# EAGLE design SFXCS (EAGLE 5.07)
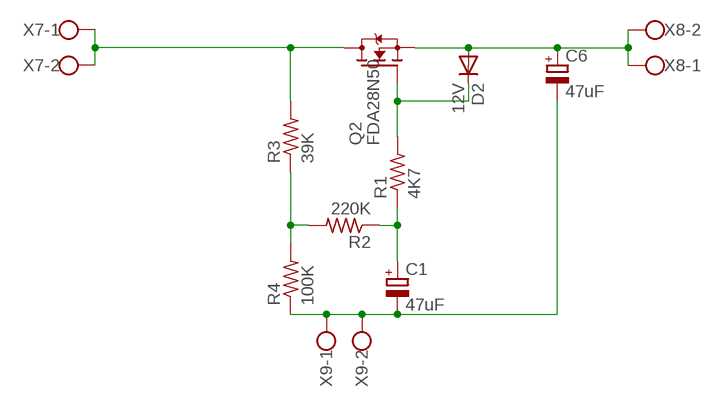
[diagram p0: schematic, sheet 1]

## Parts
C1  47uF  CPOL-EUE10-20  [EB20D]
C6  47uF  CPOL-EUE10-30  [EB30D]
D2  12V  1N4004  [DO41-10]
Q2  FDA28N50  SPW47N60S5  [P-TO247]
R1  4K7  R-US_0617/22  [0617/22]
R2  220K  R-US_0617/22  [0617/22]
R3  39K  R-US_0617/22  [0617/22]
R4  100K  R-US_0617/22  [0617/22]
X7  W237-02P  [W237-132]
X8  W237-02P  [W237-132]
X9  W237-02P  [W237-132]

## Nets
N$2: Q2.2(D) R3.2 X7.1 X7.2
N$7: D2.C Q2.1(G) R1.2
N$8: C1.+ R1.1 R2.1
N$9: R2.2 R3.1 R4.2
N$12: C6.+ D2.A Q2.3(S) X8.1 X8.2
N$14: C1.- C6.- R4.1 X9.1 X9.2

## Library data of the parts
C1 C6 = resistor:CPOL-EU: POLARIZED CAPACITOR, European symbol
D2 = diode:1N4004: DIODE general purpose rectifier, 1 A
Q2 = transistor-fet:SPW47N60S5: Cool MOS Power Transistor
R1-R4 = resistor:R-US_: RESISTOR, American symbol
X7-X9 = con-wago-508:W237-02P: WAGO SREW CLAMP

## Board
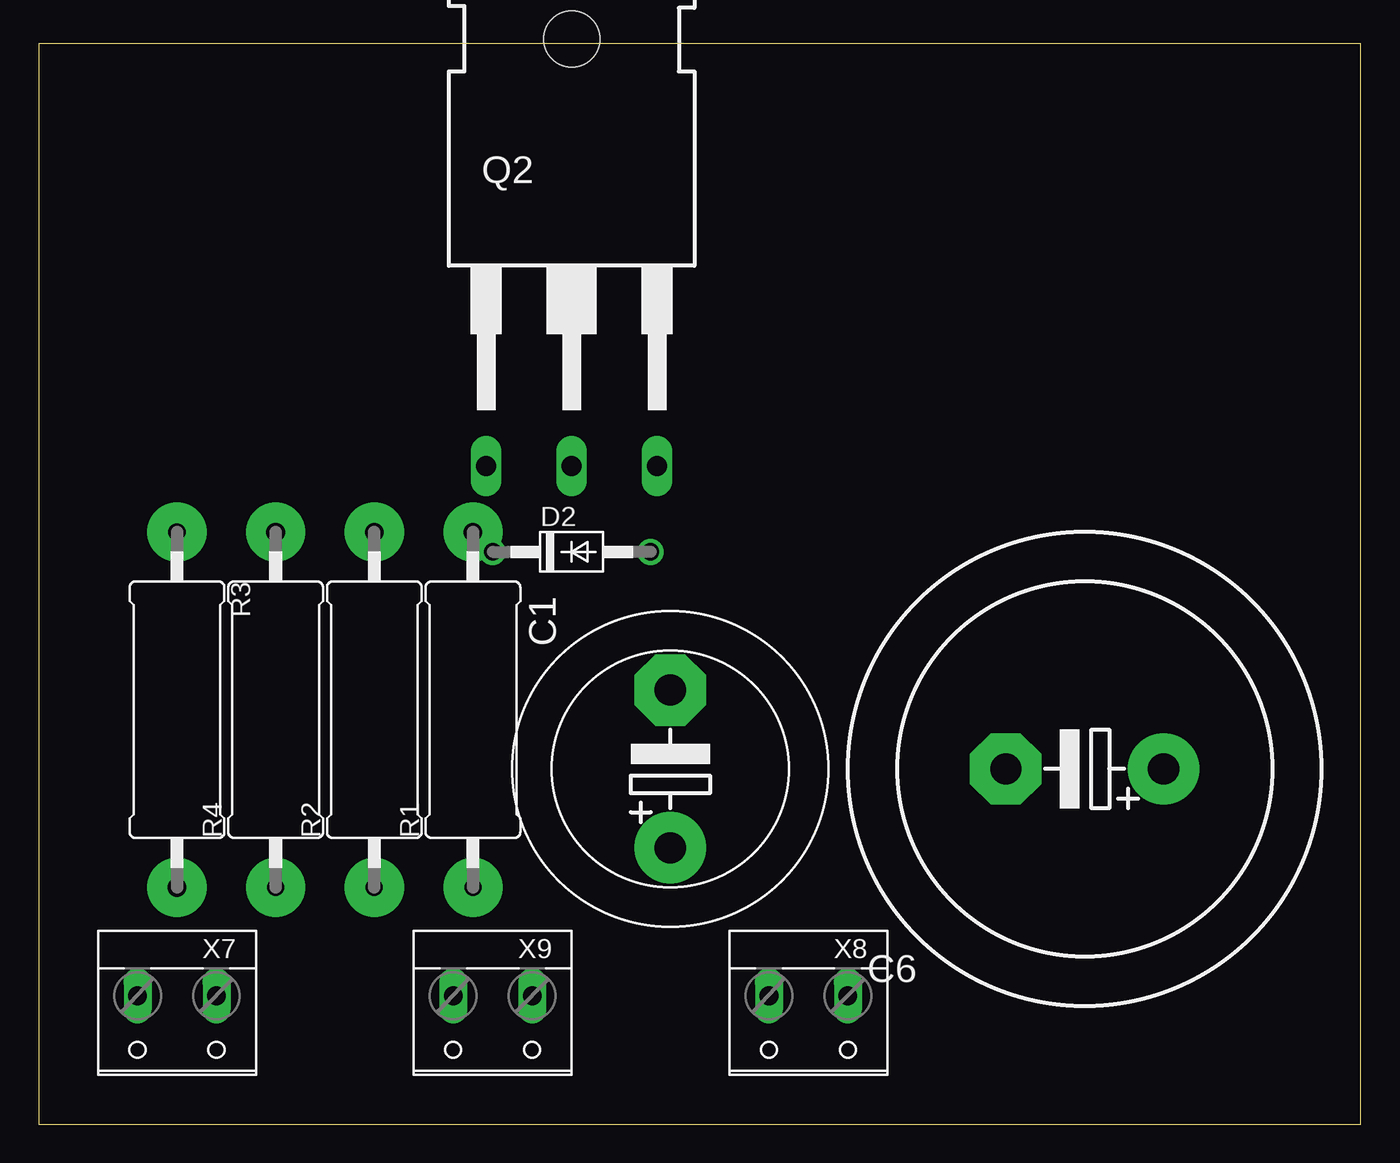
[diagram p1: board, top side]
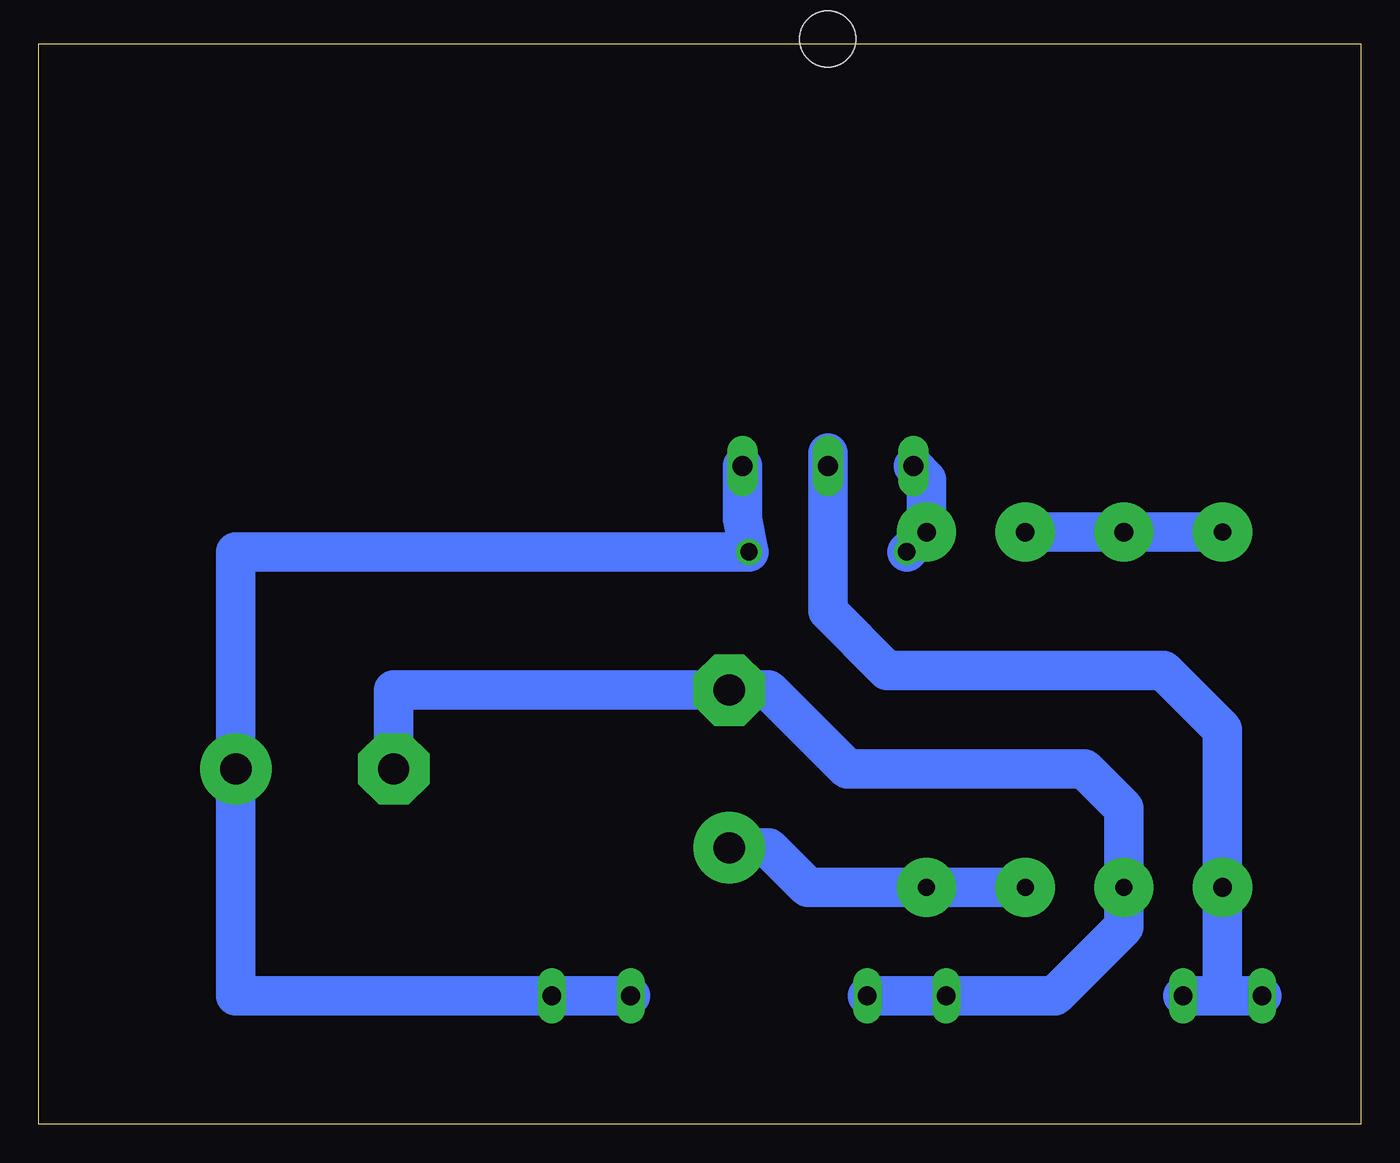
[diagram p2: board, bottom side, seen from below]

Size 85.07 x 69.52 mm. Coordinates in mm from the lower left corner, seen from the top.
Outline: 0,0 85.07,0 85.07,69.52 0,69.52 0,0
Copper layers (1*16): Top 0.035mm / dielectric 1.5mm / Bottom 0.035mm
Design rules "default": minimum track width 10mil, minimum drill 24mil, track to track 8mil, track to pad 8mil, pad to pad 8mil, via to via 8mil, smd to smd 8mil, copper to edge 40mil, drill to drill 8mil, minimum pad ring 10mil, minimum via ring 8mil, stop-mask expansion 4mil, vias tented up to drill 0mil, thermal gap 10mil

### Footprints (pad centres in the part's own frame; a part is rotated, then mirrored left to right if it is on the bottom)
EB20D = drill 2.007 pad 4.597 round: + -5.08,0 | drill 2.007 pad 4.597 octagon: - 5.08,0
EB30D = drill 2.007 pad 4.597 round: + -5.08,0 | drill 2.007 pad 4.597 octagon: - 5.08,0
DO41-10 = drill 1.118 round: A 5.08,0; C -5.08,0
P-TO247 = drill 1.3 long: 1 -5.5,-27.5; 2 0,-27.5; 3 5.5,-27.5 | hole 3.6: 0,0
0617/22 = drill 1.1 pad 3.81 round: 1 -11.43,0 | drill 1.2 pad 3.81 round: 2 11.43,0
W237-132 = drill 1.194 long: 1 -2.54,-0.635; 2 2.54,-0.635

### Placement (x,y rotation side)
C1  40.64,22.86 90 top
C6  67.31,22.86 180 top
D2  34.29,36.83 0 top
Q2  34.29,69.85 0 top
R1  27.94,26.67 90 top
R2  21.59,26.67 90 top
R3  8.89,26.67 270 top
R4  15.24,26.67 90 top
X7  8.89,7.62 180 top
X8  49.53,7.62 180 top
X9  29.21,7.62 180 top

### Tracks (layer width: path | path; a pad name or v marks a point on that pad's centre or on a via)
N$2
  Bottom 2.54: 34.29,43.18 Q2.2 34.29,33.02 30.48,29.21 12.7,29.21 8.89,25.4 R3.2 8.89,8.25 | 8.89,8.25 X7.1 | X7.2 8.89,8.25
N$7
  Bottom 2.54: Q2.1 27.94,41.5 R1.2 D2.C
N$8
  Bottom 2.54: R2.1 R1.1 35.56,15.24 38.1,17.78 C1.+
N$9
  Bottom 2.54: R3.1 R4.2 R2.2
N$12
  Bottom 2.54: Q2.3 39.79,38.95 D2.A 72.39,36.83 C6.+ 72.39,21.59 72.39,8.25 X8.1 X8.2
N$14
  Bottom 2.54: X9.1 X9.2 19.69,8.25 15.24,12.7 R4.1 15.24,20.32 17.78,22.86 33.02,22.86 38.1,27.94 C1.- 62.23,27.94 C6.-